# Altium schematic sheet [0X] - DDR3 MEMORY.SchDoc
size 513 x 386 mm
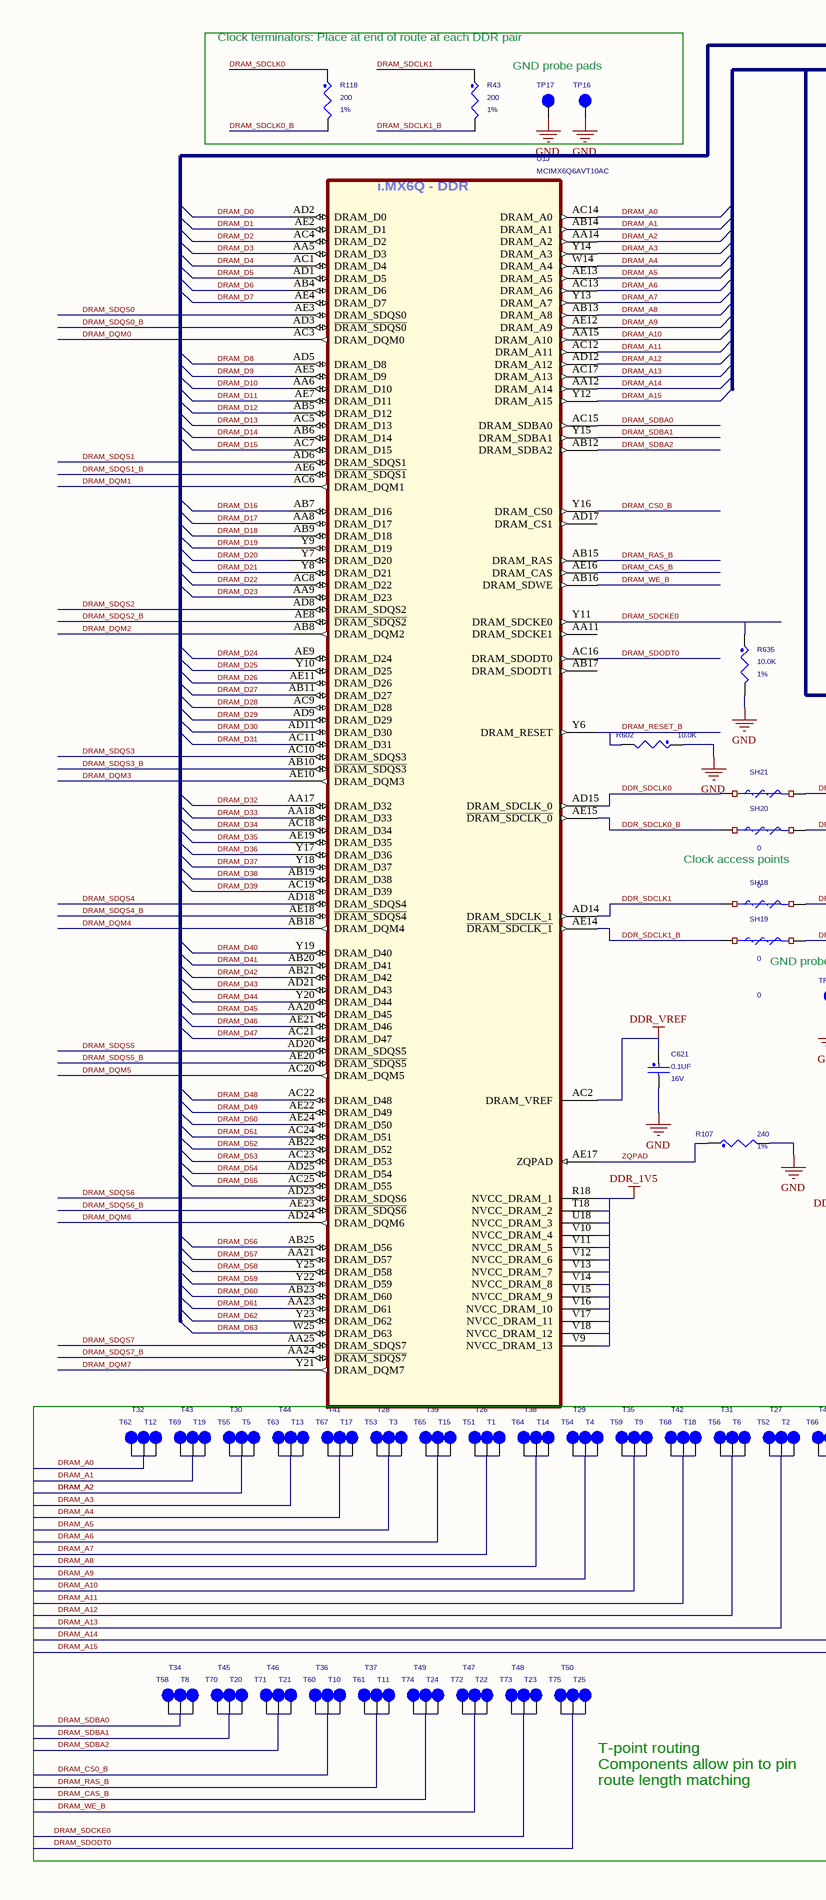
[diagram p0: [0X] - DDR3 MEMORY.SchDoc, left]
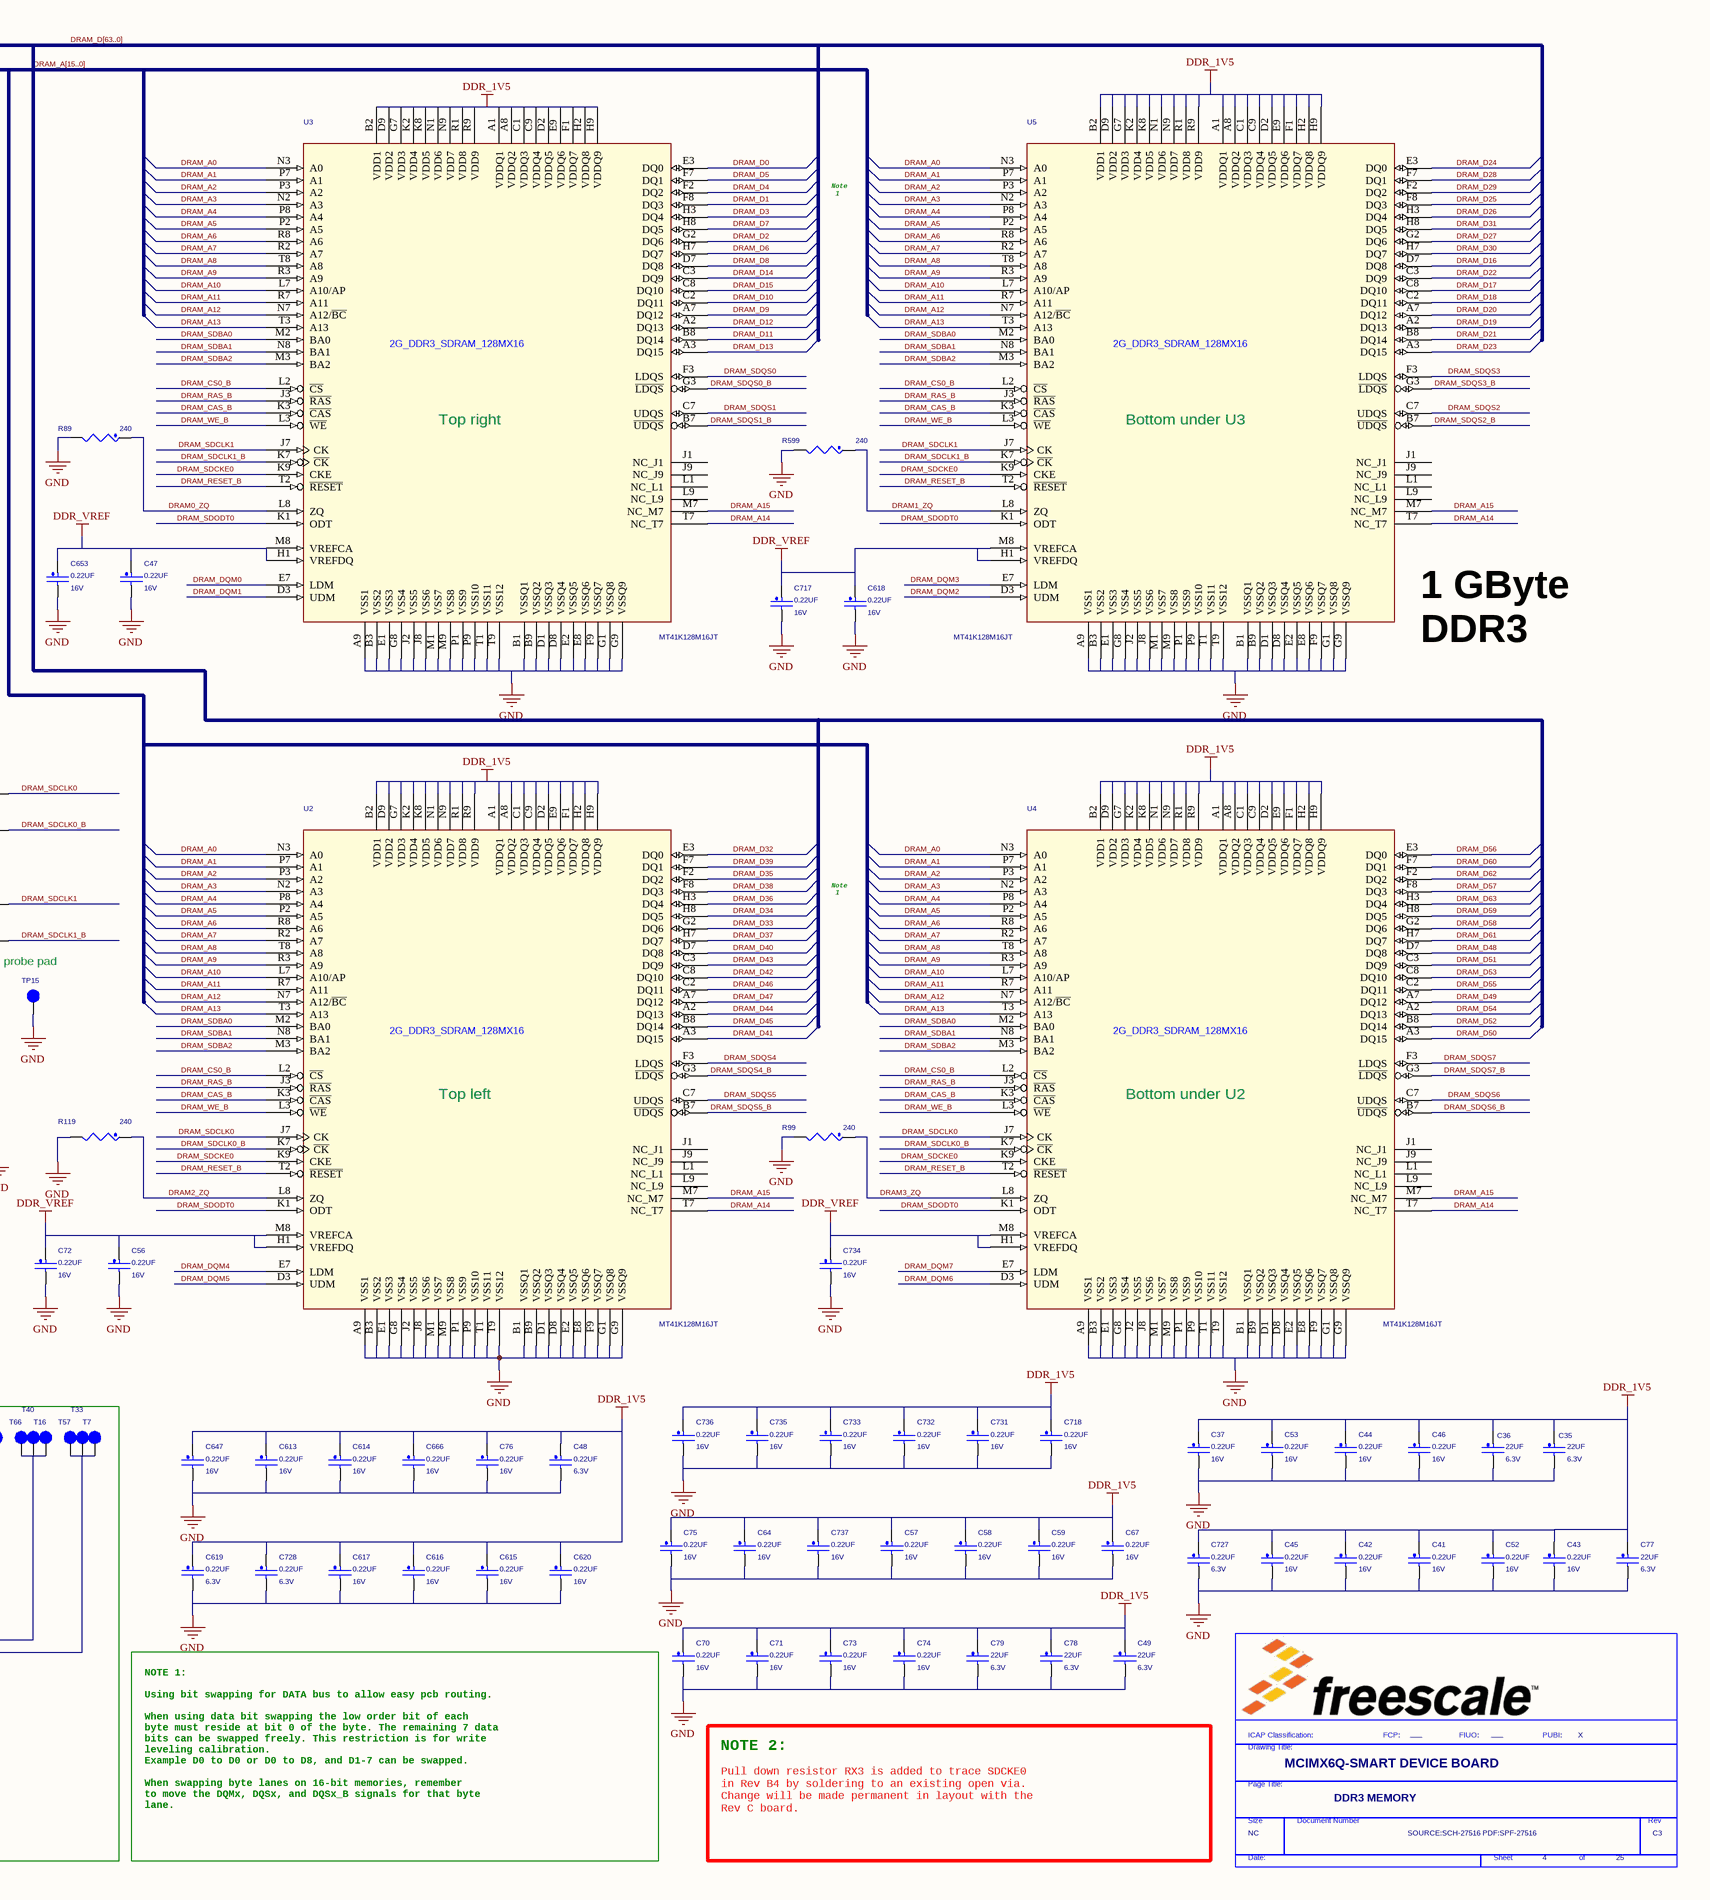
[diagram p1: [0X] - DDR3 MEMORY.SchDoc, right]

## Parts
*  FIUO: ___  PUBI: X  Doc: SOURCE:SCH-27516 PDF:SPF-27516  RevCode: C3  Title: MCIMX6Q-SMART DEVICE BOARD  Page Size: NC  Page Number: 4  Page Count: 25  PageTitle: DDR3 MEMORY  (hidden comment: TitleBlock_FS)  (graphical)
C35  22UF  WVDC: 6.3V  [0805_CC]
C36  22UF  WVDC: 6.3V  [0805_CC]
C37  0.22UF  WVDC: 16V  [0402_CC]
C41  0.22UF  WVDC: 16V  [0402_CC]
C42  0.22UF  WVDC: 16V  [0402_CC]
C43  0.22UF  WVDC: 16V  [0402_CC]
C44  0.22UF  WVDC: 16V  [0402_CC]
C45  0.22UF  WVDC: 16V  [0402_CC]
C46  0.22UF  WVDC: 16V  [0402_CC]
C47  0.22UF  WVDC: 16V  [0402_CC]
C48  0.22UF  WVDC: 6.3V  [0201_CC]
C49  22UF  WVDC: 6.3V  [0805_CC]
C52  0.22UF  WVDC: 16V  [0402_CC]
C53  0.22UF  WVDC: 16V  [0402_CC]
C56  0.22UF  WVDC: 16V  [0402_CC]
C57  0.22UF  WVDC: 16V  [0402_CC]
C58  0.22UF  WVDC: 16V  [0402_CC]
C59  0.22UF  WVDC: 16V  [0402_CC]
C64  0.22UF  WVDC: 16V  [0402_CC]
C67  0.22UF  WVDC: 16V  [0402_CC]
C70  0.22UF  WVDC: 16V  [0402_CC]
C71  0.22UF  WVDC: 16V  [0402_CC]
C72  0.22UF  WVDC: 16V  [0402_CC]
C73  0.22UF  WVDC: 16V  [0402_CC]
C74  0.22UF  WVDC: 16V  [0402_CC]
C75  0.22UF  WVDC: 16V  [0402_CC]
C76  0.22UF  WVDC: 16V  [0402_CC]
C77  22UF  WVDC: 6.3V  [0805_CC]
C78  22UF  WVDC: 6.3V  [0805_CC]
C79  22UF  WVDC: 6.3V  [0805_CC]
C613  0.22UF  WVDC: 16V  [0402_CC]
C614  0.22UF  WVDC: 16V  [0402_CC]
C615  0.22UF  WVDC: 16V  [0402_CC]
C616  0.22UF  WVDC: 16V  [0402_CC]
C617  0.22UF  WVDC: 16V  [0402_CC]
C618  0.22UF  WVDC: 16V  [0402_CC]
C619  0.22UF  WVDC: 6.3V  [0201_CC]
C620  0.22UF  WVDC: 16V  [0402_CC]
C621  0.1UF  WVDC: 16V  [0402_CC]
C647  0.22UF  WVDC: 16V  [0402_CC]
C653  0.22UF  WVDC: 16V  [0402_CC]
C666  0.22UF  WVDC: 16V  [0402_CC]
C717  0.22UF  WVDC: 16V  [0402_CC]
C718  0.22UF  WVDC: 16V  [0402_CC]
C727  0.22UF  WVDC: 6.3V  [0201_CC]
C728  0.22UF  WVDC: 6.3V  [0201_CC]
C731  0.22UF  WVDC: 16V  [0402_CC]
C732  0.22UF  WVDC: 16V  [0402_CC]
C733  0.22UF  WVDC: 16V  [0402_CC]
C734  0.22UF  WVDC: 16V  [0402_CC]
C735  0.22UF  WVDC: 16V  [0402_CC]
C736  0.22UF  WVDC: 16V  [0402_CC]
C737  0.22UF  WVDC: 16V  [0402_CC]
R43  200  Tolerance: 1%  [0402_CC]
R89  240  [0402_CC]
R99  240  [0402_CC]
R107  240  Tolerance: 1%  [0402_CC]
R118  200  Tolerance: 1%  [0402_CC]
R119  240  [0402_CC]
R599  240  [0402_CC]
R602  10.0K  [0402_CC]
R635  10.0K  Tolerance: 1%  [0402_CC]
SH18  0  [SH0201_CC]
SH19  0  [SH0201_CC]
SH20  0  [SH0201_CC]
SH21  0  [SH0201_CC]
T1  TPAD_015  [TPAD_015]  (value not drawn)
T2  TPAD_015  [TPAD_015]  (value not drawn)
T3  TPAD_015  [TPAD_015]  (value not drawn)
T4  TPAD_015  [TPAD_015]  (value not drawn)
T5  TPAD_015  [TPAD_015]  (value not drawn)
T6  TPAD_015  [TPAD_015]  (value not drawn)
T7  TPAD_015  [TPAD_015]  (value not drawn)
T8  TPAD_015  [TPAD_015]  (value not drawn)
T9  TPAD_015  [TPAD_015]  (value not drawn)
T10  TPAD_015  [TPAD_015]  (value not drawn)
T11  TPAD_015  [TPAD_015]  (value not drawn)
T12  TPAD_015  [TPAD_015]  (value not drawn)
T13  TPAD_015  [TPAD_015]  (value not drawn)
T14  TPAD_015  [TPAD_015]  (value not drawn)
T15  TPAD_015  [TPAD_015]  (value not drawn)
T16  TPAD_015  [TPAD_015]  (value not drawn)
T17  TPAD_015  [TPAD_015]  (value not drawn)
T18  TPAD_015  [TPAD_015]  (value not drawn)
T19  TPAD_015  [TPAD_015]  (value not drawn)
T20  TPAD_015  [TPAD_015]  (value not drawn)
T21  TPAD_015  [TPAD_015]  (value not drawn)
T22  TPAD_015  [TPAD_015]  (value not drawn)
T23  TPAD_015  [TPAD_015]  (value not drawn)
T24  TPAD_015  [TPAD_015]  (value not drawn)
T25  TPAD_015  [TPAD_015]  (value not drawn)
T26  TPAD_015  [TPAD_015]  (value not drawn)
T27  TPAD_015  [TPAD_015]  (value not drawn)
T28  TPAD_015  [TPAD_015]  (value not drawn)
T29  TPAD_015  [TPAD_015]  (value not drawn)
T30  TPAD_015  [TPAD_015]  (value not drawn)
T31  TPAD_015  [TPAD_015]  (value not drawn)
T32  TPAD_015  [TPAD_015]  (value not drawn)
T33  TPAD_015  [TPAD_015]  (value not drawn)
T34  TPAD_015  [TPAD_015]  (value not drawn)
T35  TPAD_015  [TPAD_015]  (value not drawn)
T36  TPAD_015  [TPAD_015]  (value not drawn)
T37  TPAD_015  [TPAD_015]  (value not drawn)
T38  TPAD_015  [TPAD_015]  (value not drawn)
T39  TPAD_015  [TPAD_015]  (value not drawn)
T40  TPAD_015  [TPAD_015]  (value not drawn)
T41  TPAD_015  [TPAD_015]  (value not drawn)
T42  TPAD_015  [TPAD_015]  (value not drawn)
T43  TPAD_015  [TPAD_015]  (value not drawn)
T44  TPAD_015  [TPAD_015]  (value not drawn)
T45  TPAD_015  [TPAD_015]  (value not drawn)
T46  TPAD_015  [TPAD_015]  (value not drawn)
T47  TPAD_015  [TPAD_015]  (value not drawn)
T48  TPAD_015  [TPAD_015]  (value not drawn)
T49  TPAD_015  [TPAD_015]  (value not drawn)
T50  TPAD_015  [TPAD_015]  (value not drawn)
T51  TPAD_015  [TPAD_015]  (value not drawn)
T52  TPAD_015  [TPAD_015]  (value not drawn)
T53  TPAD_015  [TPAD_015]  (value not drawn)
T54  TPAD_015  [TPAD_015]  (value not drawn)
T55  TPAD_015  [TPAD_015]  (value not drawn)
T56  TPAD_015  [TPAD_015]  (value not drawn)
T57  TPAD_015  [TPAD_015]  (value not drawn)
T58  TPAD_015  [TPAD_015]  (value not drawn)
T59  TPAD_015  [TPAD_015]  (value not drawn)
T60  TPAD_015  [TPAD_015]  (value not drawn)
T61  TPAD_015  [TPAD_015]  (value not drawn)
T62  TPAD_015  [TPAD_015]  (value not drawn)
T63  TPAD_015  [TPAD_015]  (value not drawn)
T64  TPAD_015  [TPAD_015]  (value not drawn)
T65  TPAD_015  [TPAD_015]  (value not drawn)
T66  TPAD_015  [TPAD_015]  (value not drawn)
T67  TPAD_015  [TPAD_015]  (value not drawn)
T68  TPAD_015  [TPAD_015]  (value not drawn)
T69  TPAD_015  [TPAD_015]  (value not drawn)
T70  TPAD_015  [TPAD_015]  (value not drawn)
T71  TPAD_015  [TPAD_015]  (value not drawn)
T72  TPAD_015  [TPAD_015]  (value not drawn)
T73  TPAD_015  [TPAD_015]  (value not drawn)
T74  TPAD_015  [TPAD_015]  (value not drawn)
T75  TPAD_015  [TPAD_015]  (value not drawn)
TP15  tpad_020  [tpad_020]  (value not drawn)
TP16  tpad_020  [tpad_020]  (value not drawn)
TP17  tpad_020  [tpad_020]  (value not drawn)
U1  MCIMX6Q6AVT10AC  [BGA624_0P8_21X21]  (part J of 12)
U2  MT41K128M16JT  [BGA15X9-96_FS]
U3  MT41K128M16JT  [BGA15X9-96_FS]
U4  MT41K128M16JT  [BGA15X9-96_FS]
U5  MT41K128M16JT  [BGA15X9-96_FS]

## Blocks framed on the sheet
Clock terminators: Place at end of route at each DDR pair: R43 R118 TP16 TP17

## Nets
DDR_1V5: C35.1 C36.1 C37.1 C41.1 C42.1 C43.1 C44.1 C45.1 C46.1 C48.1 C49.1 C52.1 C53.1 C57.1 C58.1 C59.1 C64.1 C67.1 C70.1 C71.1 C73.1 C74.1 C75.1 C76.1 C77.1 C78.1 C79.1 C613.1 C614.1 C615.1 C616.1 C617.1 C619.1 C620.1 C647.1 C666.1 C718.1 C727.1 C728.1 C731.1 C732.1 C733.1 C735.1 C736.1 C737.1 U1.R18(NVCC_DRAM_1) U1.T18(NVCC_DRAM_2) U1.U18(NVCC_DRAM_3) U1.V9(NVCC_DRAM_13) U1.V10(NVCC_DRAM_4) U1.V11(NVCC_DRAM_5) U1.V12(NVCC_DRAM_6) U1.V13(NVCC_DRAM_7) U1.V14(NVCC_DRAM_8) U1.V15(NVCC_DRAM_9) U1.V16(NVCC_DRAM_10) U1.V17(NVCC_DRAM_11) U1.V18(NVCC_DRAM_12) U2.A1(VDDQ1) U2.A8(VDDQ2) U2.B2(VDD1) U2.C1(VDDQ3) U2.C9(VDDQ4) U2.D2(VDDQ5) U2.D9(VDD2) U2.E9(VDDQ6) U2.F1(VDDQ7) U2.G7(VDD3) U2.H2(VDDQ8) U2.H9(VDDQ9) U2.K2(VDD4) U2.K8(VDD5) U2.N1(VDD6) U2.N9(VDD7) U2.R1(VDD8) U2.R9(VDD9) U3.A1(VDDQ1) U3.A8(VDDQ2) U3.B2(VDD1) U3.C1(VDDQ3) U3.C9(VDDQ4) U3.D2(VDDQ5) U3.D9(VDD2) U3.E9(VDDQ6) U3.F1(VDDQ7) U3.G7(VDD3) U3.H2(VDDQ8) U3.H9(VDDQ9) U3.K2(VDD4) U3.K8(VDD5) U3.N1(VDD6) U3.N9(VDD7) U3.R1(VDD8) U3.R9(VDD9) U4.A1(VDDQ1) U4.A8(VDDQ2) U4.B2(VDD1) U4.C1(VDDQ3) U4.C9(VDDQ4) U4.D2(VDDQ5) U4.D9(VDD2) U4.E9(VDDQ6) U4.F1(VDDQ7) U4.G7(VDD3) U4.H2(VDDQ8) U4.H9(VDDQ9) U4.K2(VDD4) U4.K8(VDD5) U4.N1(VDD6) U4.N9(VDD7) U4.R1(VDD8) U4.R9(VDD9) U5.A1(VDDQ1) U5.A8(VDDQ2) U5.B2(VDD1) U5.C1(VDDQ3) U5.C9(VDDQ4) U5.D2(VDDQ5) U5.D9(VDD2) U5.E9(VDDQ6) U5.F1(VDDQ7) U5.G7(VDD3) U5.H2(VDDQ8) U5.H9(VDDQ9) U5.K2(VDD4) U5.K8(VDD5) U5.N1(VDD6) U5.N9(VDD7) U5.R1(VDD8) U5.R9(VDD9)
DDR_VREF: C47.1 C56.1 C72.1 C618.1 C621.1 C653.1 C717.1 C734.1 U1.AC2(DRAM_VREF) U2.H1(VREFDQ) U2.M8(VREFCA) U3.H1(VREFDQ) U3.M8(VREFCA) U4.H1(VREFDQ) U4.M8(VREFCA) U5.H1(VREFDQ) U5.M8(VREFCA)
GND: C35.2 C36.2 C37.2 C41.2 C42.2 C43.2 C44.2 C45.2 C46.2 C47.2 C48.2 C49.2 C52.2 C53.2 C56.2 C57.2 C58.2 C59.2 C64.2 C67.2 C70.2 C71.2 C72.2 C73.2 C74.2 C75.2 C76.2 C77.2 C78.2 C79.2 C613.2 C614.2 C615.2 C616.2 C617.2 C618.2 C619.2 C620.2 C621.2 C647.2 C653.2 C666.2 C717.2 C718.2 C727.2 C728.2 C731.2 C732.2 C733.2 C734.2 C735.2 C736.2 C737.2 R89.2 R99.2 R107.2 R119.2 R599.2 R602.1 R635.2 TP15.1(Pin1) TP16.1(Pin1) TP17.1(Pin1) U2.A9(VSS1) U2.B1(VSSQ1) U2.B3(VSS2) U2.B9(VSSQ2) U2.D1(VSSQ3) U2.D8(VSSQ4) U2.E1(VSS3) U2.E2(VSSQ5) U2.E8(VSSQ6) U2.F9(VSSQ7) U2.G1(VSSQ8) U2.G8(VSS4) U2.G9(VSSQ9) U2.J2(VSS5) U2.J8(VSS6) U2.M1(VSS7) U2.M9(VSS8) U2.P1(VSS9) U2.P9(VSS10) U2.T1(VSS11) U2.T9(VSS12) U3.A9(VSS1) U3.B1(VSSQ1) U3.B3(VSS2) U3.B9(VSSQ2) U3.D1(VSSQ3) U3.D8(VSSQ4) U3.E1(VSS3) U3.E2(VSSQ5) U3.E8(VSSQ6) U3.F9(VSSQ7) U3.G1(VSSQ8) U3.G8(VSS4) U3.G9(VSSQ9) U3.J2(VSS5) U3.J8(VSS6) U3.M1(VSS7) U3.M9(VSS8) U3.P1(VSS9) U3.P9(VSS10) U3.T1(VSS11) U3.T9(VSS12) U4.A9(VSS1) U4.B1(VSSQ1) U4.B3(VSS2) U4.B9(VSSQ2) U4.D1(VSSQ3) U4.D8(VSSQ4) U4.E1(VSS3) U4.E2(VSSQ5) U4.E8(VSSQ6) U4.F9(VSSQ7) U4.G1(VSSQ8) U4.G8(VSS4) U4.G9(VSSQ9) U4.J2(VSS5) U4.J8(VSS6) U4.M1(VSS7) U4.M9(VSS8) U4.P1(VSS9) U4.P9(VSS10) U4.T1(VSS11) U4.T9(VSS12) U5.A9(VSS1) U5.B1(VSSQ1) U5.B3(VSS2) U5.B9(VSSQ2) U5.D1(VSSQ3) U5.D8(VSSQ4) U5.E1(VSS3) U5.E2(VSSQ5) U5.E8(VSSQ6) U5.F9(VSSQ7) U5.G1(VSSQ8) U5.G8(VSS4) U5.G9(VSSQ9) U5.J2(VSS5) U5.J8(VSS6) U5.M1(VSS7) U5.M9(VSS8) U5.P1(VSS9) U5.P9(VSS10) U5.T1(VSS11) U5.T9(VSS12)
DDR_SDCLK0: SH21.1 U1.AD15(DRAM_SDCLK_0)
DDR_SDCLK0_B: SH20.1 U1.AE15(~{DRAM_SDCLK_0})
DDR_SDCLK1: SH18.1 U1.AD14(DRAM_SDCLK_1)
DDR_SDCLK1_B: SH19.1 U1.AE14(~{DRAM_SDCLK_1})
DRAM0_ZQ: R89.1 U3.L8(ZQ)
DRAM1_ZQ: R599.1 U5.L8(ZQ)
DRAM2_ZQ: R119.1 U2.L8(ZQ)
DRAM3_ZQ: R99.1 U4.L8(ZQ)
DRAM_A0: T12.1(Pin1) T32.1(Pin1) T62.1(Pin1) U1.AC14(DRAM_A0) U1.AC22(DRAM_D48) U2.N3(A0) U3.N3(A0) U4.D7(DQ8) U4.N3(A0) U5.N3(A0)  [also labelled DRAM_D48]
DRAM_A1: T19.1(Pin1) T43.1(Pin1) T69.1(Pin1) U1.AB14(DRAM_A1) U1.AE22(DRAM_D49) U2.P7(A1) U3.P7(A1) U4.A7(DQ12) U4.P7(A1) U5.P7(A1)  [also labelled DRAM_D49]
DRAM_A2: T5.1(Pin1) T30.1(Pin1) T55.1(Pin1) U1.AA14(DRAM_A2) U1.AE24(DRAM_D50) U2.P3(A2) U3.P3(A2) U4.A3(DQ15) U4.P3(A2) U5.P3(A2)  [also labelled DRAM_D50]
DRAM_A3: T13.1(Pin1) T44.1(Pin1) T63.1(Pin1) U1.AC24(DRAM_D51) U1.Y14(DRAM_A3) U2.N2(A3) U3.N2(A3) U4.C3(DQ9) U4.N2(A3) U5.N2(A3)  [also labelled DRAM_D51]
DRAM_A4: T17.1(Pin1) T41.1(Pin1) T67.1(Pin1) U1.AB22(DRAM_D52) U1.W14(DRAM_A4) U2.P8(A4) U3.P8(A4) U4.B8(DQ14) U4.P8(A4) U5.P8(A4)  [also labelled DRAM_D52]
DRAM_A5: T3.1(Pin1) T28.1(Pin1) T53.1(Pin1) U1.AC23(DRAM_D53) U1.AE13(DRAM_A5) U2.P2(A5) U3.P2(A5) U4.C8(DQ10) U4.P2(A5) U5.P2(A5)  [also labelled DRAM_D53]
DRAM_A6: T15.1(Pin1) T39.1(Pin1) T65.1(Pin1) U1.AC13(DRAM_A6) U1.AD25(DRAM_D54) U2.R8(A6) U3.R8(A6) U4.A2(DQ13) U4.R8(A6) U5.R8(A6)  [also labelled DRAM_D54]
DRAM_A7: T1.1(Pin1) T26.1(Pin1) T51.1(Pin1) U1.AC25(DRAM_D55) U1.Y13(DRAM_A7) U2.R2(A7) U3.R2(A7) U4.C2(DQ11) U4.R2(A7) U5.R2(A7)  [also labelled DRAM_D55]
DRAM_A8: T14.1(Pin1) T38.1(Pin1) T64.1(Pin1) U1.AB13(DRAM_A8) U1.AB25(DRAM_D56) U2.T8(A8) U3.T8(A8) U4.E3(DQ0) U4.T8(A8) U5.T8(A8)  [also labelled DRAM_D56]
DRAM_A9: T4.1(Pin1) T29.1(Pin1) T54.1(Pin1) U1.AA21(DRAM_D57) U1.AE12(DRAM_A9) U2.R3(A9) U3.R3(A9) U4.F8(DQ3) U4.R3(A9) U5.R3(A9)  [also labelled DRAM_D57]
DRAM_A10: T9.1(Pin1) T35.1(Pin1) T59.1(Pin1) U1.AA15(DRAM_A10) U1.Y25(DRAM_D58) U2.L7(A10/AP) U3.L7(A10/AP) U4.G2(DQ6) U4.L7(A10/AP) U5.L7(A10/AP)  [also labelled DRAM_D58]
DRAM_A11: T18.1(Pin1) T42.1(Pin1) T68.1(Pin1) U1.AC12(DRAM_A11) U1.Y22(DRAM_D59) U2.R7(A11) U3.R7(A11) U4.H8(DQ5) U4.R7(A11) U5.R7(A11)  [also labelled DRAM_D59]
DRAM_A12: T6.1(Pin1) T31.1(Pin1) T56.1(Pin1) U1.AB23(DRAM_D60) U1.AD12(DRAM_A12) U2.N7(A12/~{BC}) U3.N7(A12/~{BC}) U4.F7(DQ1) U4.N7(A12/~{BC}) U5.N7(A12/~{BC})  [also labelled DRAM_D60]
DRAM_A13: T2.1(Pin1) T27.1(Pin1) T52.1(Pin1) U1.AA23(DRAM_D61) U1.AC17(DRAM_A13) U2.T3(A13) U3.T3(A13) U4.H7(DQ7) U4.T3(A13) U5.T3(A13)  [also labelled DRAM_D61]
DRAM_A14: T16.1(Pin1) T40.1(Pin1) T66.1(Pin1) U1.AA12(DRAM_A14) U1.Y23(DRAM_D62) U2.T7(NC_T7) U3.T7(NC_T7) U4.F2(DQ2) U4.T7(NC_T7) U5.T7(NC_T7)  [also labelled DRAM_D62]
DRAM_A15: T7.1(Pin1) T33.1(Pin1) T57.1(Pin1) U1.W25(DRAM_D63) U1.Y12(DRAM_A15) U2.M7(NC_M7) U3.M7(NC_M7) U4.H3(DQ4) U4.M7(NC_M7) U5.M7(NC_M7)  [also labelled DRAM_D63]
DRAM_CAS_B: T24.1(Pin1) T49.1(Pin1) T74.1(Pin1) U1.AE16(DRAM_CAS) U2.K3(~{CAS}) U3.K3(~{CAS}) U4.K3(~{CAS}) U5.K3(~{CAS})
DRAM_CS0_B: T10.1(Pin1) T36.1(Pin1) T60.1(Pin1) U1.Y16(DRAM_CS0) U2.L2(~{CS}) U3.L2(~{CS}) U4.L2(~{CS}) U5.L2(~{CS})
DRAM_D0: U1.AD2(DRAM_D0) U3.E3(DQ0)
DRAM_D1: U1.AE2(DRAM_D1) U3.F8(DQ3)
DRAM_D2: U1.AC4(DRAM_D2) U3.G2(DQ6)
DRAM_D3: U1.AA5(DRAM_D3) U3.H3(DQ4)
DRAM_D4: U1.AC1(DRAM_D4) U3.F2(DQ2)
DRAM_D5: U1.AD1(DRAM_D5) U3.F7(DQ1)
DRAM_D6: U1.AB4(DRAM_D6) U3.H7(DQ7)
DRAM_D7: U1.AE4(DRAM_D7) U3.H8(DQ5)
DRAM_D8: U1.AD5(DRAM_D8) U3.D7(DQ8)
DRAM_D9: U1.AE5(DRAM_D9) U3.A7(DQ12)
DRAM_D10: U1.AA6(DRAM_D10) U3.C2(DQ11)
DRAM_D11: U1.AE7(DRAM_D11) U3.B8(DQ14)
DRAM_D12: U1.AB5(DRAM_D12) U3.A2(DQ13)
DRAM_D13: U1.AC5(DRAM_D13) U3.A3(DQ15)
DRAM_D14: U1.AB6(DRAM_D14) U3.C3(DQ9)
DRAM_D15: U1.AC7(DRAM_D15) U3.C8(DQ10)
DRAM_D16: U1.AB7(DRAM_D16) U5.D7(DQ8)
DRAM_D17: U1.AA8(DRAM_D17) U5.C8(DQ10)
DRAM_D18: U1.AB9(DRAM_D18) U5.C2(DQ11)
DRAM_D19: U1.Y9(DRAM_D19) U5.A2(DQ13)
DRAM_D20: U1.Y7(DRAM_D20) U5.A7(DQ12)
DRAM_D21: U1.Y8(DRAM_D21) U5.B8(DQ14)
DRAM_D22: U1.AC8(DRAM_D22) U5.C3(DQ9)
DRAM_D23: U1.AA9(DRAM_D23) U5.A3(DQ15)
DRAM_D24: U1.AE9(DRAM_D24) U5.E3(DQ0)
DRAM_D25: U1.Y10(DRAM_D25) U5.F8(DQ3)
DRAM_D26: U1.AE11(DRAM_D26) U5.H3(DQ4)
DRAM_D27: U1.AB11(DRAM_D27) U5.G2(DQ6)
DRAM_D28: U1.AC9(DRAM_D28) U5.F7(DQ1)
DRAM_D29: U1.AD9(DRAM_D29) U5.F2(DQ2)
DRAM_D30: U1.AD11(DRAM_D30) U5.H7(DQ7)
DRAM_D31: U1.AC11(DRAM_D31) U5.H8(DQ5)
DRAM_D32: U1.AA17(DRAM_D32) U2.E3(DQ0)
DRAM_D33: U1.AA18(DRAM_D33) U2.G2(DQ6)
DRAM_D34: U1.AC18(DRAM_D34) U2.H8(DQ5)
DRAM_D35: U1.AE19(DRAM_D35) U2.F2(DQ2)
DRAM_D36: U1.Y17(DRAM_D36) U2.H3(DQ4)
DRAM_D37: U1.Y18(DRAM_D37) U2.H7(DQ7)
DRAM_D38: U1.AB19(DRAM_D38) U2.F8(DQ3)
DRAM_D39: U1.AC19(DRAM_D39) U2.F7(DQ1)
DRAM_D40: U1.Y19(DRAM_D40) U2.D7(DQ8)
DRAM_D41: U1.AB20(DRAM_D41) U2.A3(DQ15)
DRAM_D42: U1.AB21(DRAM_D42) U2.C8(DQ10)
DRAM_D43: U1.AD21(DRAM_D43) U2.C3(DQ9)
DRAM_D44: U1.Y20(DRAM_D44) U2.A2(DQ13)
DRAM_D45: U1.AA20(DRAM_D45) U2.B8(DQ14)
DRAM_D46: U1.AE21(DRAM_D46) U2.C2(DQ11)
DRAM_D47: U1.AC21(DRAM_D47) U2.A7(DQ12)
DRAM_DQM0: U1.AC3(DRAM_DQM0) U3.E7(LDM)
DRAM_DQM1: U1.AC6(DRAM_DQM1) U3.D3(UDM)
DRAM_DQM2: U1.AB8(DRAM_DQM2) U5.D3(UDM)
DRAM_DQM3: U1.AE10(DRAM_DQM3) U5.E7(LDM)
DRAM_DQM4: U1.AB18(DRAM_DQM4) U2.E7(LDM)
DRAM_DQM5: U1.AC20(DRAM_DQM5) U2.D3(UDM)
DRAM_DQM6: U1.AD24(DRAM_DQM6) U4.D3(UDM)
DRAM_DQM7: U1.Y21(DRAM_DQM7) U4.E7(LDM)
DRAM_RAS_B: T11.1(Pin1) T37.1(Pin1) T61.1(Pin1) U1.AB15(DRAM_RAS) U2.J3(~{RAS}) U3.J3(~{RAS}) U4.J3(~{RAS}) U5.J3(~{RAS})
DRAM_RESET_B: R602.2 U1.Y6(DRAM_RESET) U2.T2(~{RESET}) U3.T2(~{RESET}) U4.T2(~{RESET}) U5.T2(~{RESET})
DRAM_SDBA0: T8.1(Pin1) T34.1(Pin1) T58.1(Pin1) U1.AC15(DRAM_SDBA0) U2.M2(BA0) U3.M2(BA0) U4.M2(BA0) U5.M2(BA0)
DRAM_SDBA1: T20.1(Pin1) T45.1(Pin1) T70.1(Pin1) U1.Y15(DRAM_SDBA1) U2.N8(BA1) U3.N8(BA1) U4.N8(BA1) U5.N8(BA1)
DRAM_SDBA2: T21.1(Pin1) T46.1(Pin1) T71.1(Pin1) U1.AB12(DRAM_SDBA2) U2.M3(BA2) U3.M3(BA2) U4.M3(BA2) U5.M3(BA2)
DRAM_SDCKE0: R635.1 T23.1(Pin1) T48.1(Pin1) T73.1(Pin1) U1.Y11(DRAM_SDCKE0) U2.K9(CKE) U3.K9(CKE) U4.K9(CKE) U5.K9(CKE)
DRAM_SDCLK0: R118.1 SH21.2 U2.J7(CK) U4.J7(CK)
DRAM_SDCLK0_B: R118.2 SH20.2 U2.K7(~{CK}) U4.K7(~{CK})
DRAM_SDCLK1: R43.1 SH18.2 U3.J7(CK) U5.J7(CK)
DRAM_SDCLK1_B: R43.2 SH19.2 U3.K7(~{CK}) U5.K7(~{CK})
DRAM_SDODT0: T25.1(Pin1) T50.1(Pin1) T75.1(Pin1) U1.AC16(DRAM_SDODT0) U2.K1(ODT) U3.K1(ODT) U4.K1(ODT) U5.K1(ODT)
DRAM_SDQS0: U1.AE3(DRAM_SDQS0) U3.F3(LDQS)
DRAM_SDQS0_B: U1.AD3(~{DRAM_SDQS0}) U3.G3(~{LDQS})
DRAM_SDQS1: U1.AD6(DRAM_SDQS1) U3.C7(UDQS)
DRAM_SDQS1_B: U1.AE6(~{DRAM_SDQS1}) U3.B7(~{UDQS})
DRAM_SDQS2: U1.AD8(DRAM_SDQS2) U5.C7(UDQS)
DRAM_SDQS2_B: U1.AE8(~{DRAM_SDQS2}) U5.B7(~{UDQS})
DRAM_SDQS3: U1.AC10(DRAM_SDQS3) U5.F3(LDQS)
DRAM_SDQS3_B: U1.AB10(~{DRAM_SDQS3}) U5.G3(~{LDQS})
DRAM_SDQS4: U1.AD18(DRAM_SDQS4) U2.F3(LDQS)
DRAM_SDQS4_B: U1.AE18(~{DRAM_SDQS4}) U2.G3(~{LDQS})
DRAM_SDQS5: U1.AD20(DRAM_SDQS5) U2.C7(UDQS)
DRAM_SDQS5_B: U1.AE20(~{DRAM_SDQS5}) U2.B7(~{UDQS})
DRAM_SDQS6: U1.AD23(DRAM_SDQS6) U4.C7(UDQS)
DRAM_SDQS6_B: U1.AE23(~{DRAM_SDQS6}) U4.B7(~{UDQS})
DRAM_SDQS7: U1.AA25(DRAM_SDQS7) U4.F3(LDQS)
DRAM_SDQS7_B: U1.AA24(~{DRAM_SDQS7}) U4.G3(~{LDQS})
DRAM_WE_B: T22.1(Pin1) T47.1(Pin1) T72.1(Pin1) U1.AB16(DRAM_SDWE) U2.L3(~{WE}) U3.L3(~{WE}) U4.L3(~{WE}) U5.L3(~{WE})
ZQPAD: R107.1 U1.AE17(ZQPAD)

Not connected (* = marked no-connect by the designer): U1 AA11(DRAM_SDCKE1) AB17(DRAM_SDODT1) AD17(DRAM_CS1); U2 J1(NC_J1) J9(NC_J9) L1(NC_L1) L9(NC_L9); U3 J1(NC_J1) J9(NC_J9) L1(NC_L1) L9(NC_L9); U4 J1(NC_J1) J9(NC_J9) L1(NC_L1) L9(NC_L9); U5 J1(NC_J1) J9(NC_J9) L1(NC_L1) L9(NC_L9)

## Buses and harness runs
bus DRAM_A[15..0] = DRAM_D[63..0]

## Notes on the sheet
- GND probe pads
- Note
  1
- (near U3) Top right
- (near U5) Bottom under U3
- (near U5) 1 GByte
  DDR3
- Clock access points
- (near SH19) GND probe pad
- (near U2) Top left
- (near U4) Bottom under U2
- (near C70) NOTE 1:
  Using bit swapping for DATA bus to allow easy pcb routing.
  When using data bit swapping the low order bit of each
  byte must reside at bit 0 of the byte. The remaining 7 data
  bits can be swapped freely. This restriction is for write
  leveling calibration.
  Example D0 to D0 or D0 to D8, and D1-7 can be swapped.
  When swapping byte lanes on 16-bit memories, remember
  to move the DQMx, DQSx, and DQSx_B signals for that byte
  lane.
- T-point routing
  Components allow pin to pin
  route length matching
- NOTE 2:
- Pull down resistor RX3 is added to trace SDCKE0
  in Rev B4 by soldering to an existing open via.
  Change will be made permanent in layout with the
  Rev C board.
- (in symbol 2G_DDR3_SDRAM_128MX16_96P) 2G_DDR3_SDRAM_128MX16
- (in symbol PCIMX6Q6VV1A, part J) i.MX6Q - DDR
- (in symbol TitleBlock_FS) ICAP Classification:; FCP:; FIUO:; PUBI:; Drawing Title:; Page Title:; Size; Document Number; Rev; Date:; Sheet; of

## Library data of the parts
* = TitleBlock_FS: OrgName: Freescale Semiconductor; OrgAddr1: 6501 William Cannon Drive West; OrgAddr2: Austin, TX 78735-8598; FCP: ___; Page Create Date: March  8, 1995
C35 = CAP_NP: CAP CER 22UF 6.3V 20% X5R 0805; CLASS: DISCRETE; SIGNAL_MODEL: DEFAULT_CAPACITOR_1e+07pF_2_1; FPLIST: CC0805_OV,CC0805,0805_CC; ROOM: DDR2; PRIORITY_PN: 021-00218; CAD_APPROVED: Yes; MFG_PN01: GRM21BR60J226ME39L; MFG_NAME01: MURATA; AGILE_PN: 150-30121; HEIGHT: 1.45MM; ROHS: Yes; Tolerance: 20%; VOLTAGE: 6.3V
C36 C78 C79 = CAP_NP: CAP CER 22UF 6.3V 20% X5R 0805; CLASS: DISCRETE; AGILE_PN: 150-30121; MFG_NAME01: MURATA; MFG_PN01: GRM21BR60J226ME39L; CAD_APPROVED: Yes; PRIORITY_PN: 021-00218; ROOM: DDR2; FPLIST: CC0805_OV,CC0805,0805_CC; SIGNAL_MODEL: DEFAULT_CAPACITOR_1e+07pF_2_1; Tolerance: 20%; ROHS: Yes; HEIGHT: 1.45MM; VOLTAGE: 6.3V
C37 C42 C44 C75 C76 C613 C666 C732 C737 = CAP_NP: CAP CER 0.22UF 16V 10% X5R 0402; CLASS: DISCRETE; SIGNAL_MODEL: DEFAULT_CAPACITOR_220000pF_2_1; AGILE_PN: 150-77913; MFG_NAME01: TAIYO YUDEN; MFG_PN01: EMK105BJ224KV-F; CAD_APPROVED: Yes; FPLIST: CC0402_25,CC0402_HD,0402_CC; Tolerance: 10%; ROHS: Yes; HEIGHT: 0.55MM; VOLTAGE: 16V
C41 C46 C53 C59 C70 C736 = CAP_NP: CAP CER 0.22UF 16V 10% X5R 0402; CLASS: DISCRETE; AGILE_PN: 150-77913; MFG_NAME01: TAIYO YUDEN; MFG_PN01: EMK105BJ224KV-F; CAD_APPROVED: Yes; FPLIST: CC0402_25,CC0402_HD,0402_CC; SIGNAL_MODEL: DEFAULT_CAPACITOR_220000pF_2_1; Tolerance: 10%; ROHS: Yes; HEIGHT: 0.55MM; VOLTAGE: 16V
C43 C52 C58 C67 C71 C74 C647 C718 C735 = CAP_NP: CAP CER 0.22UF 16V 10% X5R 0402; CLASS: DISCRETE; SIGNAL_MODEL: DEFAULT_CAPACITOR_220000pF_2_1; FPLIST: CC0402_25,CC0402_HD,0402_CC; CAD_APPROVED: Yes; MFG_PN01: EMK105BJ224KV-F; MFG_NAME01: TAIYO YUDEN; AGILE_PN: 150-77913; HEIGHT: 0.55MM; ROHS: Yes; Tolerance: 10%; VOLTAGE: 16V
C45 C57 C64 C73 C614-C617 C620 C731 C733 = CAP_NP: CAP CER 0.22UF 16V 10% X5R 0402; CLASS: DISCRETE; FPLIST: CC0402_25,CC0402_HD,0402_CC; CAD_APPROVED: Yes; MFG_PN01: EMK105BJ224KV-F; MFG_NAME01: TAIYO YUDEN; AGILE_PN: 150-77913; SIGNAL_MODEL: DEFAULT_CAPACITOR_220000pF_2_1; HEIGHT: 0.55MM; ROHS: Yes; Tolerance: 10%; VOLTAGE: 16V
C47 C734 = CAP_NP: CAP CER 0.22UF 16V 10% X5R 0402; CLASS: DISCRETE; ROOM: CPU; AGILE_PN: 150-77913; MFG_NAME01: TAIYO YUDEN; MFG_PN01: EMK105BJ224KV-F; CAD_APPROVED: Yes; FPLIST: CC0402_25,CC0402_HD,0402_CC; PRIORITY_PN: 021-00278; SIGNAL_MODEL: DEFAULT_CAPACITOR_220000pF_2_1; Tolerance: 10%; ROHS: Yes; HEIGHT: 0.55MM; VOLTAGE: 16V
C48 = CAP_NP: CAP CER 0.22UF 6.3V 20% X5R 0201; CLASS: DISCRETE; PRIORITY_PN: 021-00278; FPLIST: CC0201,CC0201_HD,0201_CC,cc_0201_cir; CAD_APPROVED: Yes; MFG_PN01: JMK063BJ224MP-F; MFG_NAME01: TAIYO YUDEN; AGILE_PN: 150-77852; ROOM: CPU; SIGNAL_MODEL: DEFAULT_CAPACITOR_220000pF_2_1; HEIGHT: 0.33 MM; ROHS: Yes; Tolerance: 20%; VOLTAGE: 6.3V
C49 = CAP_NP: CAP CER 22UF 6.3V 20% X5R 0805; CLASS: DISCRETE; SIGNAL_MODEL: DEFAULT_CAPACITOR_2.2e+07pF_2_1; PRIORITY_PN: 021-00276; FPLIST: CC0805_OV,CC0805,0805_CC; CAD_APPROVED: Yes; MFG_PN01: GRM21BR60J226ME39L; MFG_NAME01: MURATA; AGILE_PN: 150-30121; HEIGHT: 1.45MM; ROHS: Yes; Tolerance: 20%; VOLTAGE: 6.3V
C56 C618 = CAP_NP: CAP CER 0.22UF 16V 10% X5R 0402; CLASS: DISCRETE; SIGNAL_MODEL: DEFAULT_CAPACITOR_220000pF_2_1; ROOM: CPU; AGILE_PN: 150-77913; MFG_NAME01: TAIYO YUDEN; MFG_PN01: EMK105BJ224KV-F; CAD_APPROVED: Yes; FPLIST: CC0402_25,CC0402_HD,0402_CC; PRIORITY_PN: 021-00278; Tolerance: 10%; ROHS: Yes; HEIGHT: 0.55MM; VOLTAGE: 16V
C72 C717 = CAP_NP: CAP CER 0.22UF 16V 10% X5R 0402; CLASS: DISCRETE; PRIORITY_PN: 021-00278; FPLIST: CC0402_25,CC0402_HD,0402_CC; CAD_APPROVED: Yes; MFG_PN01: EMK105BJ224KV-F; MFG_NAME01: TAIYO YUDEN; AGILE_PN: 150-77913; ROOM: CPU; SIGNAL_MODEL: DEFAULT_CAPACITOR_220000pF_2_1; HEIGHT: 0.55MM; ROHS: Yes; Tolerance: 10%; VOLTAGE: 16V
C77 = CAP_NP: CAP CER 22UF 6.3V 20% X5R 0805; CLASS: DISCRETE; AGILE_PN: 150-30121; MFG_NAME01: MURATA; MFG_PN01: GRM21BR60J226ME39L; CAD_APPROVED: Yes; FPLIST: CC0805_OV,CC0805,0805_CC; PRIORITY_PN: 021-00276; SIGNAL_MODEL: DEFAULT_CAPACITOR_2.2e+07pF_2_1; Tolerance: 20%; ROHS: Yes; HEIGHT: 1.45MM; VOLTAGE: 6.3V
C619 C727 = CAP_NP: CAP CER 0.22UF 6.3V 20% X5R 0201; CLASS: DISCRETE; ROOM: CPU; AGILE_PN: 150-77852; MFG_NAME01: TAIYO YUDEN; MFG_PN01: JMK063BJ224MP-F; CAD_APPROVED: Yes; FPLIST: CC0201,CC0201_HD,0201_CC,cc_0201_cir; PRIORITY_PN: 021-00273; SIGNAL_MODEL: DEFAULT_CAPACITOR_220000pF_2_1; Tolerance: 20%; ROHS: Yes; HEIGHT: 0.33 MM; VOLTAGE: 6.3V
C621 = CAP_NP: CAP CER 0.1UF 16V 10% X7R 0402; CLASS: DISCRETE; SIGNAL_MODEL: DEFAULT_CAPACITOR_100000pF_2_1; PRIORITY_PN: 021-00274; FPLIST: CC0402_25,CC0402_HD,0402_CC; CAD_APPROVED: Yes; MFG_PN01: C0402C104K4RAC; MFG_NAME01: KEMET; AGILE_PN: 150-75182; HEIGHT: 0.635MM; ROHS: Yes; Tolerance: 10%; VOLTAGE: 16V
C653 = CAP_NP: CAP CER 0.22UF 16V 10% X5R 0402; CLASS: DISCRETE; SIGNAL_MODEL: DEFAULT_CAPACITOR_220000pF_2_1; PRIORITY_PN: 021-00278; FPLIST: CC0402_25,CC0402_HD,0402_CC; CAD_APPROVED: Yes; MFG_PN01: EMK105BJ224KV-F; MFG_NAME01: TAIYO YUDEN; AGILE_PN: 150-77913; ROOM: CPU; HEIGHT: 0.55MM; ROHS: Yes; Tolerance: 10%; VOLTAGE: 16V
C728 = CAP_NP: CAP CER 0.22UF 6.3V 20% X5R 0201; CLASS: DISCRETE; PRIORITY_PN: 021-00273; FPLIST: CC0201,CC0201_HD,0201_CC,cc_0201_cir; CAD_APPROVED: Yes; MFG_PN01: JMK063BJ224MP-F; MFG_NAME01: TAIYO YUDEN; AGILE_PN: 150-77852; ROOM: CPU; SIGNAL_MODEL: DEFAULT_CAPACITOR_220000pF_2_1; HEIGHT: 0.33 MM; ROHS: Yes; Tolerance: 20%; VOLTAGE: 6.3V
R43 = RES: RES MF 200 OHM 1/16W 1% 0402; CLASS: DISCRETE; SIGNAL_MODEL: DEFAULT_RESISTOR_200OHM_2_1; ROOM: IMX6X_SOC; AGILE_PN: 470-76255; MFG_NAME01: THYE MING TECH CO LTD; MFG_PN01: CR02FL6--200R; CAD_APPROVED: Yes; FPLIST: RC0402_25,RC0402_HD,0402_CC; PRIORITY_PN: 006-00658; ROHS: Yes
R89 = RES: RES MF 240 OHM 1/16W 1% 0402; CLASS: DISCRETE; SIGNAL_MODEL: DEFAULT_RESISTOR_240OHM_2_1; AGILE_PN: 470-30776; MFG_NAME01: KOA SPEER; MFG_PN01: RK73H1ETTP2400F; CAD_APPROVED: Yes; FPLIST: RC0402_25,RC0402_HD,0402_CC; PRIORITY_PN: 006-00878; Tolerance: 1%; ROHS: Yes
R99 = RES: RES MF 240 OHM 1/16W 1% 0402; CLASS: DISCRETE; SIGNAL_MODEL: DEFAULT_RESISTOR_240OHM_2_1; PRIORITY_PN: 006-00878; FPLIST: RC0402_25,RC0402_HD,0402_CC; CAD_APPROVED: Yes; MFG_PN01: RK73H1ETTP2400F; MFG_NAME01: KOA SPEER; AGILE_PN: 470-30776; ROHS: Yes; Tolerance: 1%
R107 R119 R599 = RES: RES MF 240 OHM 1/16W 1% 0402; CLASS: DISCRETE; PRIORITY_PN: 006-00878; FPLIST: RC0402_25,RC0402_HD,0402_CC; CAD_APPROVED: Yes; MFG_PN01: RK73H1ETTP2400F; MFG_NAME01: KOA SPEER; AGILE_PN: 470-30776; SIGNAL_MODEL: DEFAULT_RESISTOR_240OHM_2_1; ROHS: Yes
  R119 R599: Tolerance: 1%
R118 = RES: RES MF 200 OHM 1/16W 1% 0402; CLASS: DISCRETE; SIGNAL_MODEL: DEFAULT_RESISTOR_200OHM_2_1; PRIORITY_PN: 006-00658; FPLIST: RC0402_25,RC0402_HD,0402_CC; CAD_APPROVED: Yes; MFG_PN01: CR02FL6--200R; MFG_NAME01: THYE MING TECH CO LTD; AGILE_PN: 470-76255; ROOM: IMX6X_SOC; ROHS: Yes
R602 = RES: RES MF 10.0K 1/16W 1% 0402; CLASS: DISCRETE; AGILE_PN: 470-75416; MFG_NAME01: VISHAY INTERTECHNOLOGY; MFG_PN01: CRCW040210K0FKED; CAD_APPROVED: Yes; FPLIST: RC0402,rc0402_frs; PRIORITY_PN: 006-00552; ROOM: KEYPAD; SIGNAL_MODEL: DEFAULT_RESISTOR_10000OHM_2_1; Tolerance: 1%; ROHS: Yes
R635 = RES: RES MF 10.0K 1/16W 1% 0402; CLASS: DISCRETE; SIGNAL_MODEL: DEFAULT_RESISTOR_10000OHM_2_1; ROOM: KEYPAD; PRIORITY_PN: 006-00552; FPLIST: RC0402,rc0402_frs; CAD_APPROVED: Yes; MFG_PN01: CRCW040210K0FKED; MFG_NAME01: VISHAY INTERTECHNOLOGY; AGILE_PN: 470-75416; ROHS: Yes
SH18-SH21 = RES_SHORT-2: ZERO OHM CUT TRACE 0201 PADS; NO PART TO ORDER; CLASS: DISCRETE; FPLIST: SH0201,SH0201_CC; CAD_APPROVED: Yes; ASSY_OPT: DNP; MFG_PN01: LAYOUT ELEMENT ONLY; AGILE_PN: 470-76473; ROHS: Yes; MFG_NAME01: LAYOUT ELEMENT ONLY
T1-T25 T51-T61 T63-T75 = TESTLOOP: TEST POINT PAD 15MIL DIA SMT, NO PART TO ORDER; CLASS: IO; CAD_APPROVED: Yes; ASSY_OPT: DNP; MFG_PN01: NOTACOMPONENT; AGILE_PN: 211-76645; HEIGHT: 0.1MM; ROHS: Yes; MFG_NAME01: NOTACOMPONENT
T26-T50 T62 = TESTLOOP: TEST POINT PAD 15MIL DIA SMT, NO PART TO ORDER; CLASS: IO; AGILE_PN: 211-76645; MFG_NAME01: NOTACOMPONENT; ASSY_OPT: DNP; CAD_APPROVED: Yes; MFG_PN01: NOTACOMPONENT; ROHS: Yes; HEIGHT: 0.1MM
TP15 TP16 = TESTLOOP: TEST POINT PAD 0.5MM DIA SMT, NO PART TO ORDER; CLASS: IO; CAD_APPROVED: Yes; ASSY_OPT: DNP; AGILE_PN: 211-77484; HEIGHT: 0.1MM; ROHS: Yes
TP17 = TESTLOOP: TEST POINT PAD 0.5MM DIA SMT, NO PART TO ORDER; CLASS: IO; AGILE_PN: 211-77484; ASSY_OPT: DNP; CAD_APPROVED: Yes; ROHS: Yes; HEIGHT: 0.1MM
U1 = PCIMX6Q6VV1A: IC MCU MX6QUAD ARM CORTEX-A9 FCPBGA624; AGILE_PN: 344-01218; MFG_NAME01: FREESCALE SEMICONDUCTOR; CAD_APPROVED: Yes; CLASS: IC; MFG_PN01: MCIMX6Q6AVT10AC; ROHS: Yes; HEIGHT: 2.16MM
U2-U4 = 2G_DDR3_SDRAM_128MX16_96P: IC MEM DDR3 SDRAM 2Gb 128MX16 1.35V FBGA96; AGILE_PN: 334-77489; MFG_NAME01: MICRON; MFG_PN01: MT41K128M16JT-125:K; CAD_APPROVED: Yes; CLASS: IC; ROHS: Yes; HEIGHT: 1.2 MM
U5 = 2G_DDR3_SDRAM_128MX16_96P: IC MEM DDR3 SDRAM 2Gb 128MX16 1.35V FBGA96; CAD_APPROVED: Yes; MFG_PN01: MT41K128M16JT-125:K; MFG_NAME01: MICRON; AGILE_PN: 334-77489; CLASS: IC; HEIGHT: 1.2 MM; ROHS: Yes